# EAGLE design pinoccio-backpack (EAGLE 6.2)
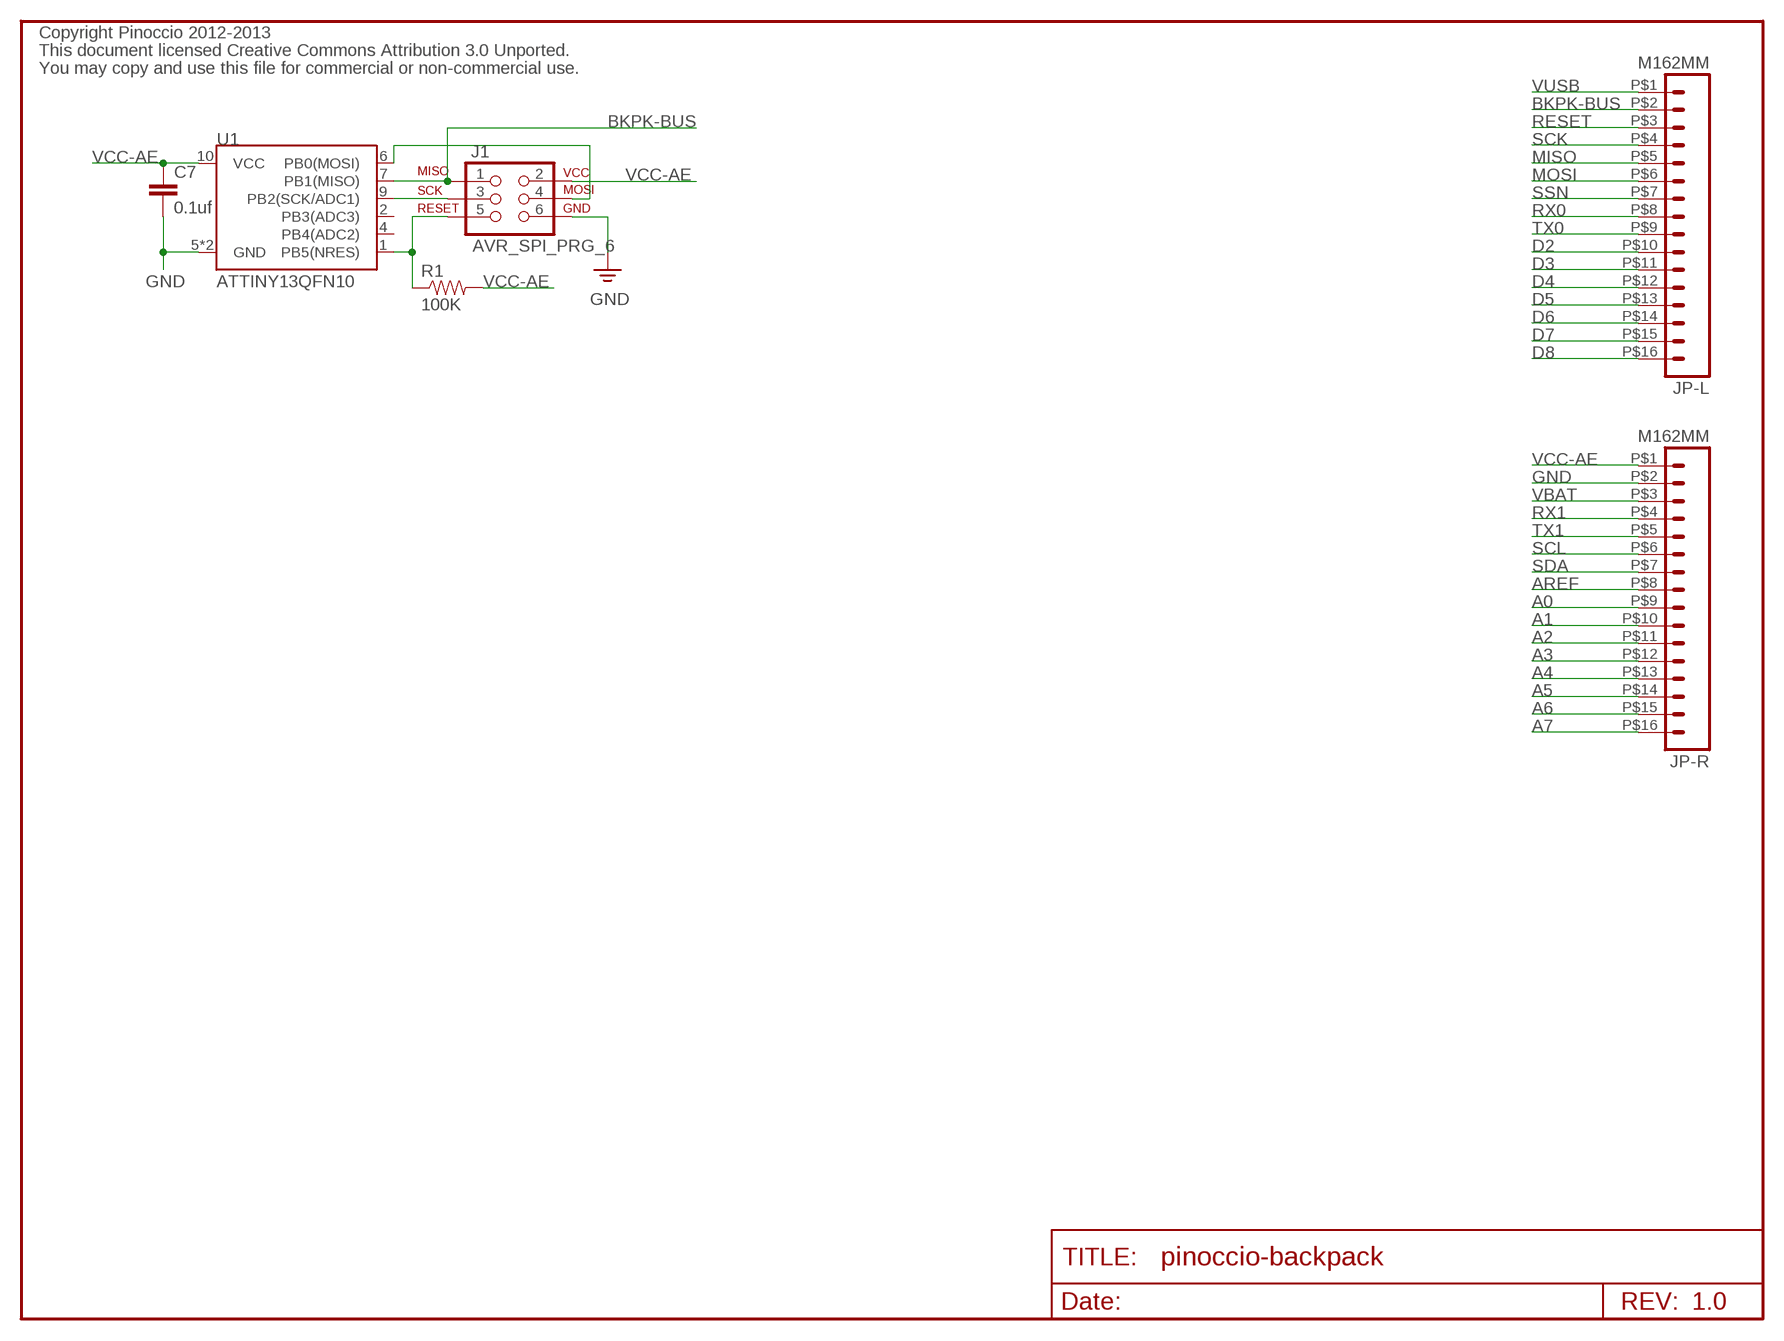
[diagram p0: schematic, sheet 1]

## Parts
C7  0.1uf  CAP0402-CAP  [0402-CAP]
J1  AVR_SPI_PRG_6  [2X3-PAD]
JP-L  M162MM  [1X16_2MM]
JP-R  M162MM  [1X16_2MM]
R1  100K  RESISTOR0402-RES  [0402-RES]
U1  ATTINY13QFN10  [QFN-10]

## Nets
A0: JP-R.P$9
A1: JP-R.P$10
A2: JP-R.P$11
A3: JP-R.P$12
A4: JP-R.P$13
A5: JP-R.P$14
A6: JP-R.P$15
A7: JP-R.P$16
AREF: JP-R.P$8
BKPK-BUS: J1.1 JP-L.P$2 U1.7(PB1(MISO))
D2: JP-L.P$10
D3: JP-L.P$11
D4: JP-L.P$12
D5: JP-L.P$13
D6: JP-L.P$14
D7: JP-L.P$15
D8: JP-L.P$16
GND [GND]: C7.2 J1.6 JP-R.P$2 U1.5(GND) U1.EP(GND)
MISO: JP-L.P$5
MOSI: JP-L.P$6
N$1: J1.4 U1.6(PB0(MOSI))
N$3: J1.3 U1.9(PB2(SCK/ADC1))
N$4: J1.5 R1.1 U1.1(PB5(NRES))
RESET: JP-L.P$3
RX0: JP-L.P$8
RX1: JP-R.P$4
SCK: JP-L.P$4
SCL: JP-R.P$6
SDA: JP-R.P$7
SSN: JP-L.P$7
TX0: JP-L.P$9
TX1: JP-R.P$5
VBAT: JP-R.P$3
VCC-AE: C7.1 J1.2 JP-R.P$1 R1.2 U1.10(VCC)
VUSB: JP-L.P$1
Unconnected: U1.2(PB3(ADC3)) U1.4(PB4(ADC2))

## Notes on the sheet
- Copyright Pinoccio 2012-2013
- This document licensed Creative Commons Attribution 3.0 Unported.
- You may copy and use this file for commercial or non-commercial use.
- 1.0
- /Volumes/Data/Users/eric/Desktop/pinoccio.bmp
- /Volumes/Data/Users/eric/Desktop/pinoccio-1in.bmp | /Volumes/Data/Users/eric/Desktop/pinoccio-full-3-4in.bmp | /Volumes/Data/Users/eric/Desktop/pinoccio-full-3-4in.bmp

## Library data of the parts
C7 = Pinoccio:CAP: Capacitor Standard 0603 ceramic capacitor, and 0.1" leaded capacitor.
J1 = Pinoccio:AVR_SPI_PRG_6: AVR ISP 6 Pin This is the reduced ISP connector for AVR programming. Common on Arduino. This footprint will take up less PCB space and can be used with a 10-pin to 6-pin adapter such as SKU: BOB-08508
JP-L JP-R = Pinoccio:M16
R1 = Pinoccio:RESISTOR: Resistor Basic schematic elements and footprints for 0603, 1206, and PTH resistors.
U1 = Pinoccio:ATTINY13

## Net classes
0 Default: width 0.203 mm
1 VCC: width 0.305 mm
2 LEDPower: width 0.203 mm
3 ButtonSignal: width 0.203 mm
4 RF Antenna: width 0.305 mm
5 GND: width 0.203 mm

## Board
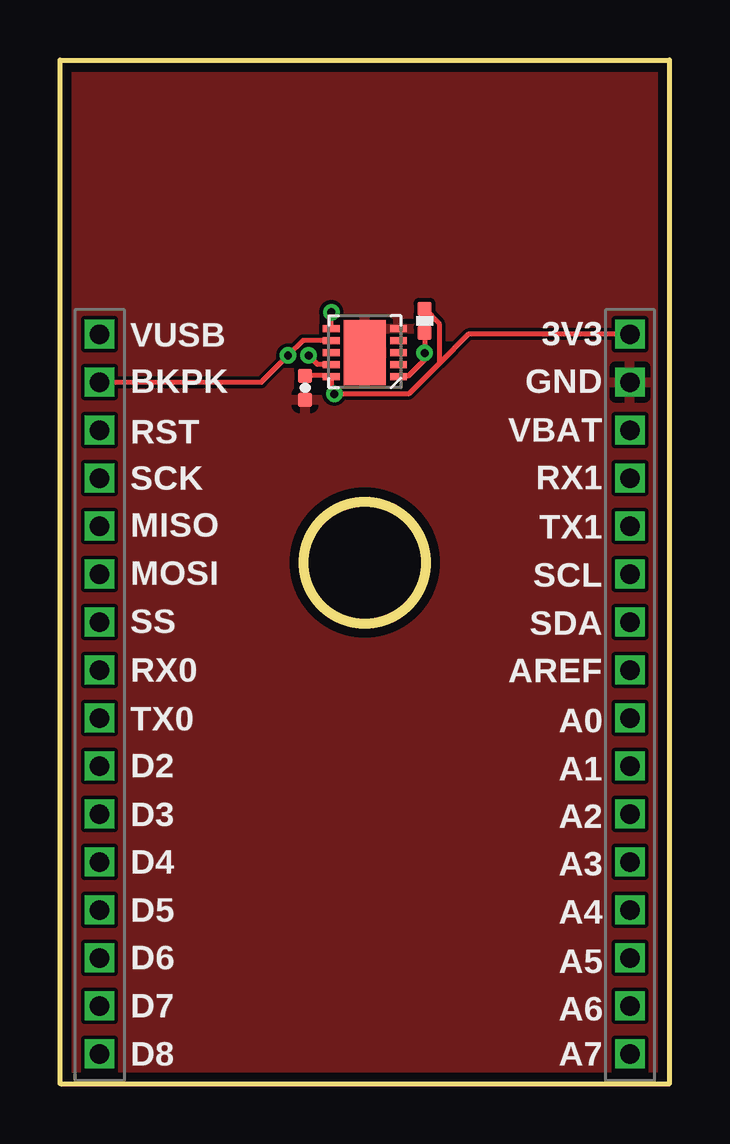
[diagram p1: board, top side]
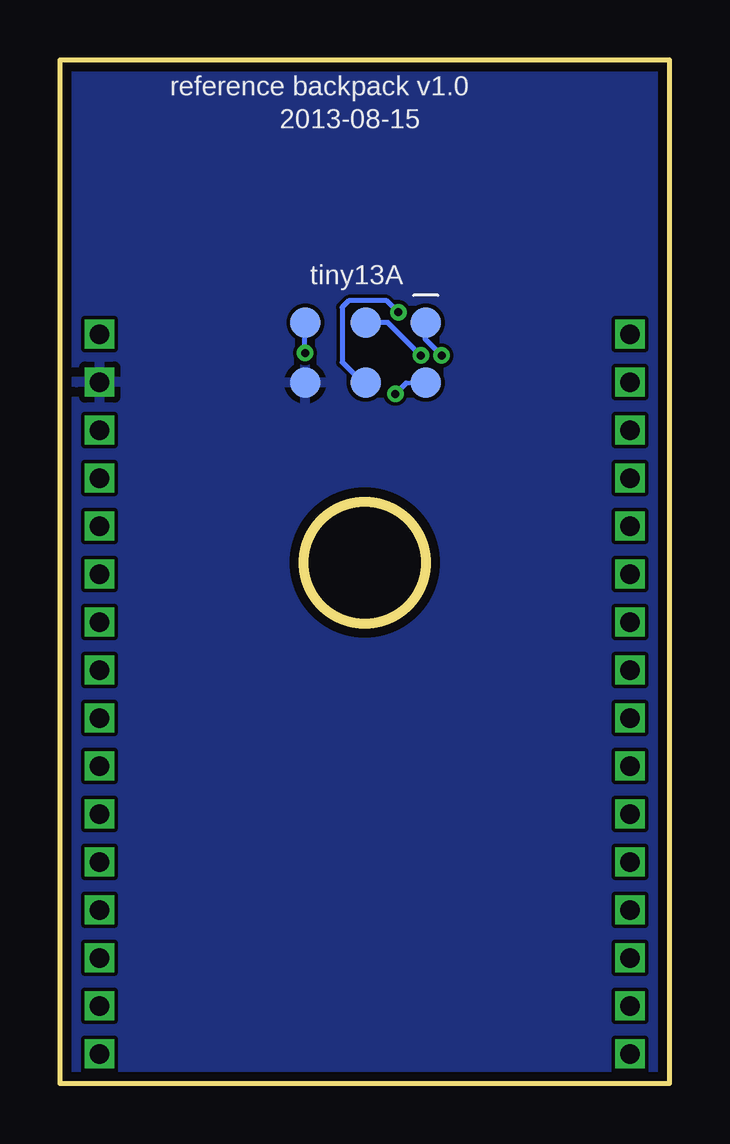
[diagram p2: board, bottom side, seen from below]

Size 25.4 x 42.67 mm. Coordinates in mm from the lower left corner, seen from the top.
Outline: 0,0 0,42.67 25.4,42.67 25.4,0 0.03,0
Outline: circle at 12.7,21.72 radius 2.54
Copper layers (1*16): Top 0.0356mm / dielectric 1.5011mm / Bottom 0.0356mm
Design rules: minimum track width 6mil, minimum drill 13mil, track to track 6mil, track to pad 6mil, pad to pad 6mil, via to via 6mil, smd to smd 6mil, copper to edge 15mil, drill to drill 6mil, minimum pad ring 7mil, minimum via ring 7mil, stop-mask expansion 4mil, vias tented up to drill 16mil, thermal gap 10mil

### Footprints (pad centres in the part's own frame; a part is rotated, then mirrored left to right if it is on the bottom)
0402-CAP = smd 0.6 x 0.6: 1 -0.5,0; 2 0.5,0
2X3-PAD = smd 1.27 x 1.27: 1 0,0; 2 0,2.508; 3 2.508,0; 4 2.508,2.508; 5 5.016,0; 6 5.016,2.508
1X16_2MM = drill 0.813 square: P$1 0,0; P$2 2,0; P$3 4,0; P$4 6,0; P$5 8,0; P$6 10,0; P$7 12,0; P$8 14,0; P$9 16,0; P$10 18,0; P$11 20,0; P$12 22,0; P$13 24,0; P$14 26,0; P$15 28,0; P$16 30,0
0402-RES = smd 0.6 x 0.6: 1 -0.5,0; 2 0.5,0
QFN-10 = smd 0.7 x 0.3: 1 -1.4,1; 2 -1.4,0.5; 3 -1.4,0; 4 -1.4,-0.5; 5 -1.4,-1; 6 1.4,-1; 7 1.4,-0.5; 8 1.4,0; 9 1.4,0.5; 10 1.4,1 | smd 1.75 x 2.7: EP 0,0

### Placement (x,y rotation side)
C7  10.21,29.01 270 top
J1  10.16,31.72 180 bottom
JP-L  1.65,31.24 270 top
JP-R  23.75,31.24 270 top
R1  15.19,31.8 90 top
U1  12.7,30.48 180 top

### Tracks (layer width: path | path; a pad name or v marks a point on that pad's centre or on a via)
BKPK-BUS  (via drill 0.33)
  Top 0.203: U1.7 10.13,30.98 v9.5,30.35 8.39,29.24 JP-L.P$2
  Bottom 0.203: v9.5,30.35 10.19,31.04 J1.1
GND
  pour Top: 0.08,42.82 0.03,42.82 -0.03,0.08 25.32,0.08 25.35,0.1 25.37,42.77 0.08,42.77
  pour Bottom: 0.08,42.65 0.03,42.65 -0.03,0.08 24.84,0.05 25.3,0.05 25.32,0.51 25.37,42.75 0.1,42.75
N$1  (via drill 0.33)
  Top 0.203: v11.3,32.15 v11.3,32.16 U1.6
  Bottom 0.203: v11.3,32.16 11.79,32.64 13.36,32.64 13.64,32.36 13.64,30.07 12.78,29.22 J1.4
N$3  (via drill 0.33)
  Top 0.203: U1.9 10.74,29.98 v10.36,30.35
  Bottom 0.203: v10.36,30.35 11.73,31.73 J1.3
N$4  (via drill 0.33)
  Top 0.203: U1.1 14.13,29.52 14.53,29.52 15.19,30.17 v15.19,30.45 R1.1
  Bottom 0.203: v15.19,30.45 15.2,30.47 J1.5
VCC-AE  (via drill 0.33)
  Top 0.203: C7.1 11.22,29.51 11.28,29.46 U1.10 11.3,28.91 v11.43,28.75 14.53,28.75 15.8,30.02 | JP-R.P$1 17.02,31.24 15.8,30.02 | R1.2 15.8,31.69 15.8,30.02
  Bottom 0.203: v11.43,28.75 10.98,29.21 J1.2

### Text on the board
tPlace: 3V3 | VUSB | GND | BKPK | VBAT | RST | RX1 | SCK | TX1 | MISO | SCL | MOSI | SDA | SS | AREF | RX0 | A0 | TX0 | A1 | D2 | A2 | D3 | A3 | D4 | A4 | D5 | A5 | D6 | A6 | D7 | A7 | D8
bPlace: reference backpack v1.0 | 2013-08-15 | tiny13A
tDocu: Pinoccio(tm) Backpack Reference v1.0 | Design by: Eric Jennings for Pinoccio | http://pinocc.io | Licensed under Creative Commons Attribution 3.0 Unported.